# Altium schematic sheet 数字时钟设计.SCHDOC
size A4
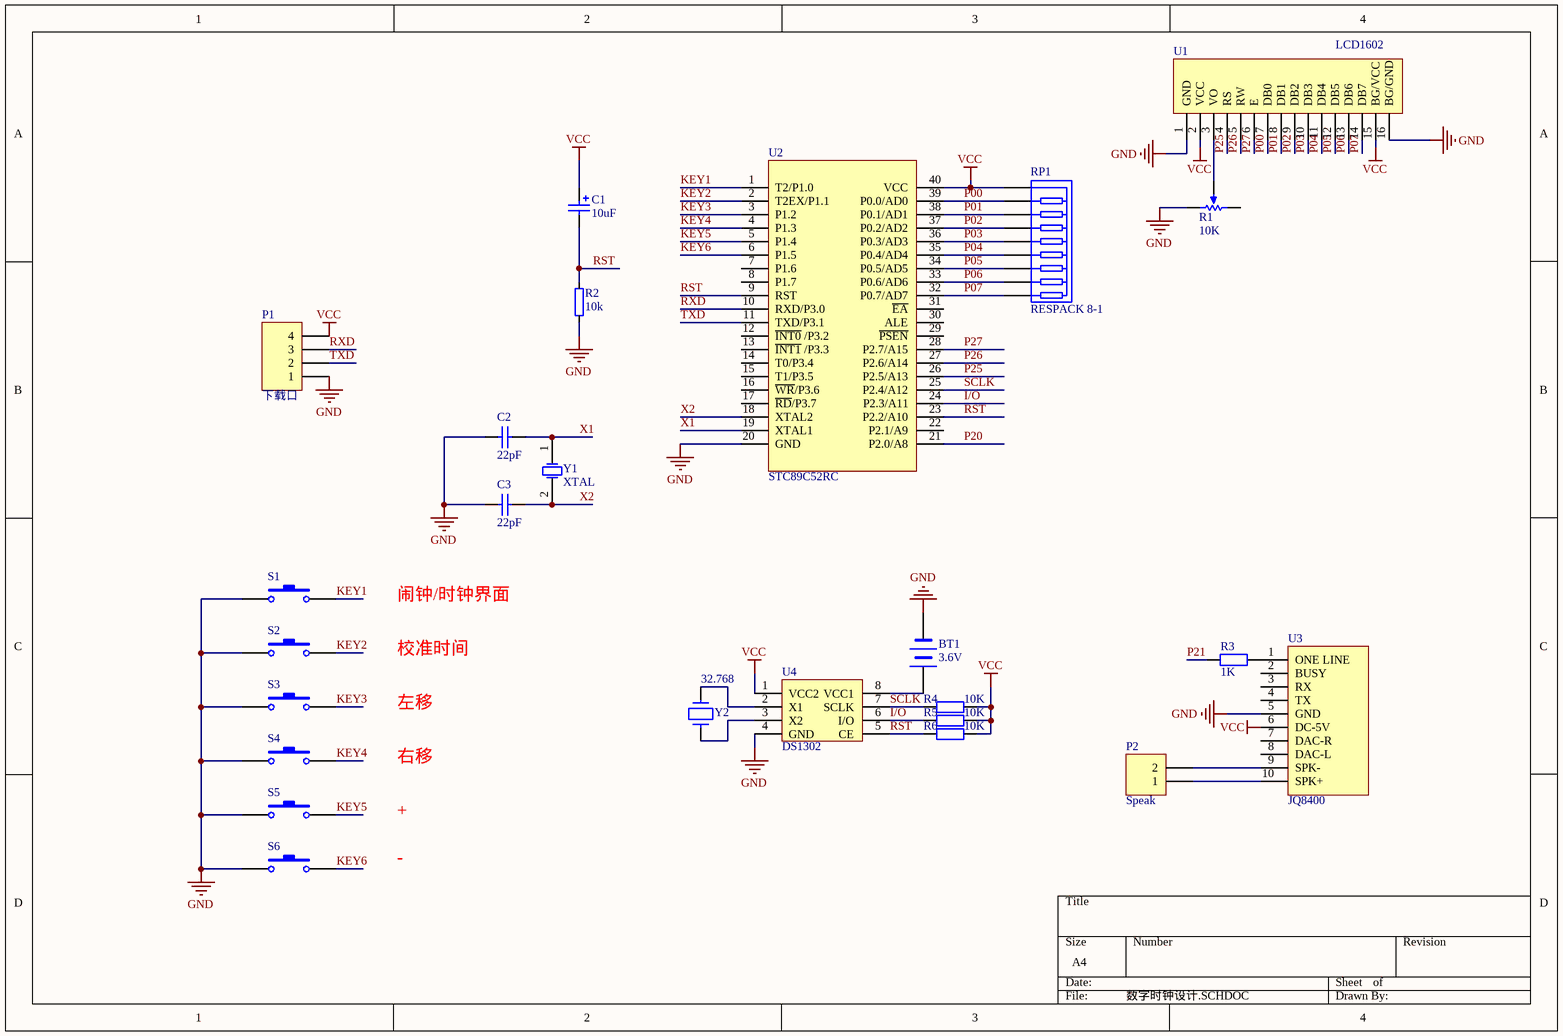
[diagram p0: 数字时钟设计.SCHDOC]

## Parts
BT1  3.6V  [BT1220]
C1  10uF  [1206C+]
C2  value 22pF  [0805]  (hidden comment: Cap)
C3  value 22pF  [0805]  (hidden comment: Cap)
P1  下载口  [HDR1X4]
P2  Speak  [HDR1X2]
R1  value 10K  [VR5]  (hidden comment: RPot)
R2  10k  [0805]
R3  value 1K  [AXIAL-0.4]  (hidden comment: Res2)
R4  10K  [0603r]
R5  10K  [0603r]
R6  10K  [0603r]
RP1  RESPACK 8-1  [SIP9]
S1  (no value)  [KEY]
S2  (no value)  [KEY]
S3  (no value)  [KEY]
S4  (no value)  [KEY]
S5  (no value)  [KEY]
S6  (no value)  [KEY]
U1  LCD1602  [HDR1X16]
U2  STC89C52RC  [DIP40]
U3  JQ8400
U4  DS1302
Y1  XTAL  [XTAL]
Y2  32.768  [XTAL_2x6]

## Nets
GND: BT1.2(-) C2.1 C3.1 P1.1 R1.2(BOT) R2.1 S1.1 S2.1 S3.1 S4.1 S5.1 S6.1 U1.1(GND) U1.16(BG/GND) U2.20(GND) U3.5(GND) U4.4(GND)
VCC: C1.1 P1.4 R4.2 R5.2 R6.2 RP1.1 U1.2(VCC) U1.15(BG/VCC) U2.40(VCC) U3.6(DC-5V) U4.1(VCC2)
I/O: R5.1 U2.24(P2.3/A11) U4.6(I/O)
KEY1: S1.2 U2.1(T2/P1.0)
KEY2: S2.2 U2.2(T2EX/P1.1)
KEY3: S3.2 U2.3(P1.2)
KEY4: S4.2 U2.4(P1.3)
KEY5: S5.2 U2.5(P1.4)
KEY6: S6.2 U2.6(P1.5)
P00: RP1.2 U1.7(DB0) U2.39(P0.0/AD0)
P01: RP1.3 U1.8(DB1) U2.38(P0.1/AD1)
P02: RP1.4 U1.9(DB2) U2.37(P0.2/AD2)
P03: RP1.5 U1.10(DB3) U2.36(P0.3/AD3)
P04: RP1.6 U1.11(DB4) U2.35(P0.4/AD4)
P05: RP1.7 U1.12(DB5) U2.34(P0.5/AD5)
P06: RP1.8 U1.13(DB6) U2.33(P0.6/AD6)
P07: RP1.9 U1.14(DB7) U2.32(P0.7/AD7)
P20: U2.21(P2.0/A8)
P21: R3.1
P25: U1.4(RS) U2.26(P2.5/A13)
P26: U1.5(RW) U2.27(P2.6/A14)
P27: U1.6(E) U2.28(P2.7/A15)
RST: C1.2 R2.2 R6.1 U2.9(RST) U2.23(P2.2/A10) U4.5(CE)
RXD: P1.3 U2.10(RXD/P3.0)
SCLK: R4.1 U2.25(P2.4/A12) U4.7(SCLK)
TXD: P1.2 U2.11(TXD/P3.1)
X1: C2.2 U2.19(XTAL1) Y1.1(OSC1)
X2: C3.2 U2.18(XTAL2) Y1.2(OSC2)
NetBT1_1: BT1.1(+) U4.8(VCC1)
NetP2_1: P2.1 U3.10(SPK+)
NetP2_2: P2.2 U3.9(SPK-)
NetR1_3: R1.3(TAP) U1.3(VO)
NetR3_2: R3.2 U3.1(ONE_LINE)
NetU4_2: U4.2(X1) Y2.2
NetU4_3: U4.3(X2) Y2.1

Not connected (* = marked no-connect by the designer): R1 1(TOP); U2 7(P1.6) 8(P1.7) 12(~{INT0}_/P3.2) 13(~{INT1}_/P3.3) 14(T0/P3.4) 15(T1/P3.5) 16(~{WR}/P3.6) 17(~{RD}/P3.7) 22(P2.1/A9) 29(~{PSEN}) 30(ALE) 31(~{EA}); U3 2(BUSY) 3(RX) 4(TX) 7(DAC-R) 8(DAC-L)

## Notes on the sheet
- 闹钟/时钟界面
- 校准时间
- 左移
- 右移
- +
- -

## Library data of the parts
BT1 = BATTERY
C1 = Cap Pol2: Polarized Capacitor (Axial); Value: 100pF; Published: 8-Jun-2000; LatestRevisionDate: 17-Jul-2002; LatestRevisionNote: Re-released for DXP Platform.; PackageReference: POLAR0.8; Publisher: Altium Limited; PackageDescription: Polarized Capacitor; 2 Leads
C2 C3 = Cap: Capacitor; Published: 8-Jun-2000; LatestRevisionDate: 17-Jul-2002; LatestRevisionNote: Re-released for DXP Platform.; PackageReference: RAD-0.3; Publisher: Altium Limited; PackageDescription: Radial Cap, Thru-Hole; 2 Leads; 0.3 in Pin Spacing
P1 = Header 4: Header, 4-Pin; LatestRevisionDate: 17-Jul-2002; LatestRevisionNote: Re-released for DXP Platform.; Publisher: Altium Limited
P2 = Header 2: Header, 2-Pin; LatestRevisionDate: 17-Jul-2002; LatestRevisionNote: Re-released for DXP Platform.; Publisher: Altium Limited
R1 = RPot: Potentiometer; Sim Note: Enter the Resistance value and the set point into parameter fields.; Set Position: 0.5; Published: 8-Jun-2000; LatestRevisionDate: 17-Jul-2002; LatestRevisionNote: Re-released for DXP Platform.; PackageReference: VR5; Publisher: Altium Limited; PackageDescription: Variable Resistor, Thru-Hole; 3 Leads
R2 = RES5
R3 = Res2: Resistor; Published: 8-Jun-2000; LatestRevisionDate: 17-Jul-2002; LatestRevisionNote: Re-released for DXP Platform.; PackageReference: AXIAL-0.4; Publisher: Altium Limited; PackageDescription: Axial Device, Thru-Hole; 2 Leads; 0.4 in Pin Spacing
R4-R6 = Res2: Resistor; Value: 1K; Published: 8-Jun-2000; LatestRevisionDate: 17-Jul-2002; LatestRevisionNote: Re-released for DXP Platform.; PackageReference: AXIAL-0.4; Publisher: Altium Limited; PackageDescription: Axial Device, Thru-Hole; 2 Leads; 0.4 in Pin Spacing
S1-S6 = SW-PB: Switch; Published: 24-Mar-1999; LatestRevisionDate: 17-Jul-2002; LatestRevisionNote: Re-released for DXP Platform.; PackageReference: SPST-2; Publisher: Altium Limited; PackageDescription: Switch; 2 Leads
Y1 = XTAL: Crystal Oscillator; Published: 8-Jun-2000; LatestRevisionDate: 17-Jul-2002; LatestRevisionNote: Re-released for DXP Platform.; PackageReference: R38; Publisher: Altium Limited; PackageDescription: Crystal, Thru-Hole; 2 Leads; Body 3.1 x 8.2 mm (Dia.xH)
Y2 = CRYSTAL